# Altium schematic sheet PowerSupply.SchDoc
size A4; SheetNumber: 1; SheetTotal: 3
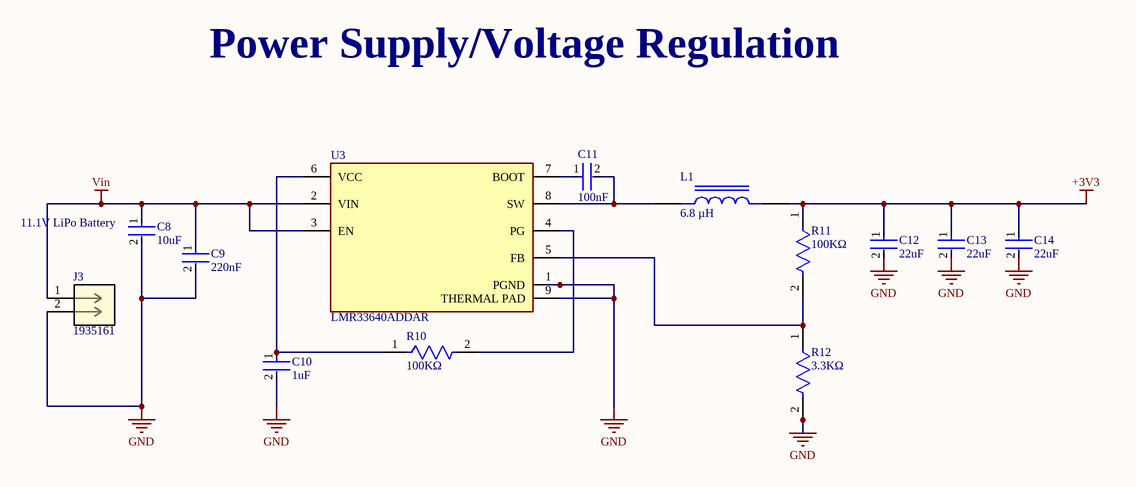
[diagram p0: PowerSupply.SchDoc]

## Parts
C8  10uF  [FP-CL21-IPC_A]
C9  220nF  [FP-CL21-IPC_B]
C10  1uF  [FP-CL10-IPC_C]
C11  100nF  [FP-CL21-IPC_C]
C12  22uF  [FP-CL21-IPC_C]
C13  22uF  [FP-CL21-IPC_C]
C14  22uF  [FP-CL21-IPC_C]
J3  1935161  [CONN_1935161_PXC]
L1  6.8 µH  [IND_SRN8040TA-6R8M]
R10  100KΩ  [FP-CRGP2512-IPC_C]
R11  100KΩ  [FP-CRGP2512-IPC_C]
R12  3.3KΩ  [FP-CRGP2512-IPC_C]
U3  LMR33640ADDAR  [FP-DDA0008J-IPC_A]

## Nets
+3V3: C12.1 C13.1 C14.1 L1.2 R11.1
GND: C8.2 C9.2 C10.2 C12.2 C13.2 C14.2 J3.2 R12.2 U3.1(PGND) U3.9(THERMAL_PAD)
Vin: C8.1 C9.1 J3.1 U3.2(VIN) U3.3(EN)
NetC10_1: C10.1 R10.1 U3.6(VCC)
NetC11_1: C11.1 U3.7(BOOT)
NetC11_2: C11.2 L1.1 U3.8(SW)
NetR10_2: R10.2 U3.4(PG)
NetR11_2: R11.2 R12.1 U3.5(FB)

## Notes on the sheet
- Power Supply/Voltage Regulation
- (near C8) 11.1V LiPo Battery

## Library data of the parts
C8 = CMP-13271-002975-1: CL21A106KAYNNNE CL21 Series 0805 10uF 25V ±10% Tolerance X5R Multilayer Ceramic Chip Capacitor; Case Code (Imperial): 0805; Length: 2mm; Case/Package: 0805; Packaging: Tape and Reel; Width: 0.049inch; Tolerance: 10%; Mount: Surface Mount; Min Operating Temperature: -55°C; Thickness: 0.057inch; Height: 1.25mm; Dielectric: X5R; Package Quantity: 1; Depth: 1.25mm; Capacitance: 10uF; Voltage Rating: 25V; Case Code (Metric): 2012; Max Operating Temperature: 85°C; Radiation Hardening: No
C9 = CMP-13271-002523-1: CL21B224KAFNNNE CL21 Series 0805 220nF 25V ±10% Tolerance X7R Multilayer Ceramic Chip Capacitor; Depth: 1.25mm; Case/Package: 0805; Mount: Surface Mount; Length: 2mm; Voltage Rating: 25V; Dielectric: X7R; Max Operating Temperature: 125°C; Thickness: 0.053inch; Case Code (Metric): 2012; Capacitance: 220nF; Package Quantity: 1; Radiation Hardening: No; Height: 1.25mm; Tolerance: 10%; Contact Plating: Tin; Packaging: Tape and Reel; Case Code (Imperial): 0805; Min Operating Temperature: -55°C; Width: 0.049inch
C10 = CMP-13271-004127-1: CL10A105KA8NNNC Cap Ceramic 1uF 25V X5R ±10% Pad SMD 0603 +85°C T/R; Height: 0.8mm; Capacitance: 1uF; Depth: 0.8mm; Package Quantity: 1; Mount: Surface Mount; Contact Plating: Tin; Voltage Rating: 25V; Dielectric: X5R; Packaging: Tape and Reel; Material: Ceramic; Case Code (Metric): 1608; Length: 1.6mm; Voltage: 25V; Min Operating Temperature: -55°C; Width: 0.031inch; Tolerance: 10%; Case/Package: 0603; Radiation Hardening: No; Case Code (Imperial): 0603; Thickness: 0.035inch; Lead Free: Lead Free; Max Operating Temperature: 85°C; Voltage Rating (DC): 25V
C11 = CMP-13271-002854-1: CL21B104KACNNNC CL21 Series 0805 100nF 25V ±10% Tolerance X7R Multilayer Ceramic Chip Capacitor; Thickness: 0.037inch; Dielectric: X7R; Packaging: Tape and Reel; Height: 0.85mm; Case/Package: 0805; Mount: Surface Mount; Case Code (Imperial): 0805; Capacitance: 100nF; Case Code (Metric): 2012; Length: 2mm; Voltage Rating: 25V; Voltage: 25V; Contact Plating: Tin; Tolerance: 10%; Max Operating Temperature: 125°C; Width: 0.049inch; Min Operating Temperature: -55°C; Radiation Hardening: No; Package Quantity: 1; Depth: 1.25mm
C12-C14 = CMP-13271-003225-1: CL21A226MAYNNNE CL21 Series 0805 22uF 25V ±20% Tolerance X5R Multilayer Ceramic Chip Capacitor
J3 = 1935161: Ceramic Capacitor, Multilayer, Ceramic, 16V, 10% +Tol, 10% -Tol, X5R, 15% TC, 10uF, Surface Mount, 0805; Mfr_Name: Phoenix Contact; Manufacturer: Samsung; Manufacturer Part Number: CL21A106KOQNNNE; Multilayer: Yes; RefDes: RefDes; Type: Type; Supplier: Digikey; Supplier Part Number: 1276-1096-1-ND; RoHS: Yes; Category: Ceramic Capacitors; Stock: 3573508; Pricing: 1=0.1, 10=0.07, 50=0.0404, 100=0.0313, 500=0.02354, 1000=0.0185 (USD); Mounting Technology: Surface Mount; Pins: 2; Dielectric Material: Ceramic; Package Shape: Rectangular; Case/Package: 0805; Terminal Finish: Nickel; Min Operating Temperature: -55°C; Max Operating Temperature: 85°C; JESD-609 Code: e3; Value: 10uF; Capacitor Type: Ceramic; Tolerance  (fill in as +-): 10%; Package Style: SMTMeter; Packaging: Tape and Reel; Tolerance (fill in as +-): 10%; Rated DC Voltage (URdc): 16V; Temperature Characteristics Code: X5R; Termination: Wraparound; Length: 2mm; Width: 1.25mm; Height: 1.4mm; Reach SVHC Compliant: Yes; RoHS Compliant: Yes; ComponentLink1URL: https://datasheet.ciiva.com:443/pdfs/VipMasterIC/IC/SEMS/SEMS-S-A0008520559/SEMS-S-A0008520510-1.pdf?src-supplier=IHS+Markit; ComponentLink1Description: https://datasheet.ciiva.com:443/pdfs/VipMasterIC/IC/SEMS/SEMS-S-A0008520559/SEMS-S-A0008520510-1.pdf?src-supplier=IHS+Markit; ComponentLink2URL: https://datasheet.ciiva.com/15216/getdatasheetpartid-358435-15216234.pdf?src-supplier=Verical; ComponentLink2Description: https://datasheet.ciiva.com/15216/getdatasheetpartid-358435-15216234.pdf?src-supplier=Verical; ComponentLink3URL: https://datasheet.ciiva.com/25798/cl21a106koqnnne-25798133.pdf?src-supplier=Digikey; ComponentLink3Description: https://datasheet.ciiva.com/25798/cl21a106koqnnne-25798133.pdf?src-supplier=Digikey
L1 = SRN8040TA-6R8M: SRN8040TA-6R8M FIXED IND 6.8UH 5.1A 25 MOHM SMD; Package: None; Price: None; Value: *; MP: SRN8040TA-6R8M; Availability: Unavailable
R10 R11 = CMP-03211-001791-1: CRGP2512F100K CRGP2512 100KΩ 2W ±100ppm/°C 1% 500V; Manufacturer: TE; Tolerance: 0.01; Ambient Temperature Range High: +70°C; Package: CRGP2512; Lead Free: Yes; ComponentLink2URL: https://www.mouser.ca/datasheet/2/418/NG_DS_9-1773463-9_A-1358566.pdf; Device Class L2: Resistors; Ipc Land Pattern Name: RESC635320X55; Temperature Coefficient: ±100ppm/°C; Voltage Rating: 500V; Temperature: -55°C to +155°C; Category: Res; Composition: Thick Film; Octopart: https://octopart.com/crgp2512f100k-te+connectivity-91019024; RoHS: TRUE; Power Rating: 2W; Device Class L1: Passive Components; Temperature Range High: +155°C; Temperature Range Low: -55°C; Series: CRGP; Device Class L3: Chip SMD Resistors; Manufacturer Part Number: CRGP2512F100K; Height: 0.65mm; Resistance: 100KΩ; Value: 100KΩ; ComponentLink2Description: Datasheet; Automotive: No
R12 = CMP-03211-004979-1: CRGP2512F3K3 CRGP2512 3.3KΩ 2W ±100ppm/°C 1% 500V; Manufacturer: TE; Tolerance: 0.01; Height: 0.65mm; RoHS: TRUE; Power Rating: 2W; Package: CRGP2512; Device Class L3: Chip SMD Resistors; Temperature Coefficient: ±100ppm/°C; Lead Free: Yes; Automotive: No; Category: Res; Octopart: https://octopart.com/crgp2512f3k3-te+connectivity-91019064; Composition: Thick Film; Series: CRGP; Resistance: 3.3KΩ; Temperature Range High: +155°C; Ambient Temperature Range High: +70°C; Manufacturer Part Number: CRGP2512F3K3; Temperature Range Low: -55°C; Device Class L2: Resistors; Value: 3.3KΩ; Temperature: -55°C to +155°C; ComponentLink2URL: https://www.mouser.ca/datasheet/2/418/NG_DS_9-1773463-9_A-1358566.pdf; Ipc Land Pattern Name: RESC635320X55; Voltage Rating: 500V; Device Class L1: Passive Components; ComponentLink2Description: Datasheet
U3 = CMP-04918-000399-1: 36V 4A 400KHZ REGULATOR